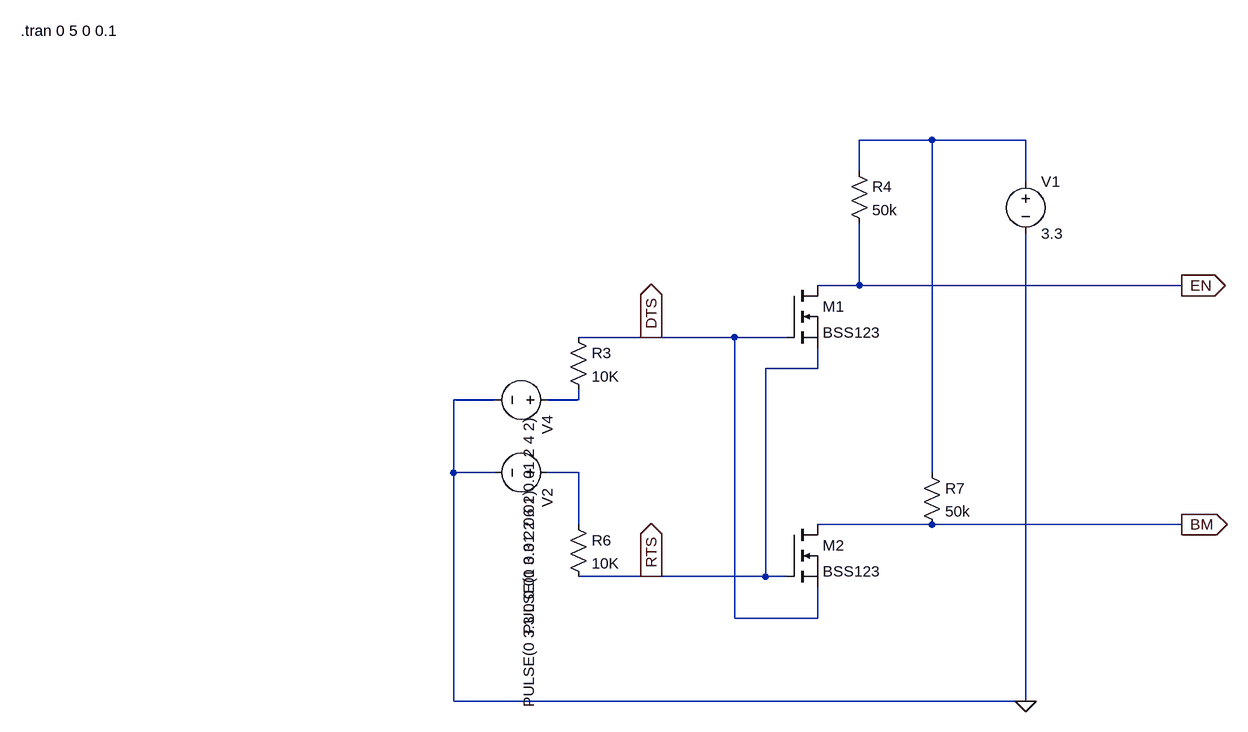
[diagram p0: schematic autoreset_wroom.asc]
autoreset_wroom.asc, the LTspice schematic file:
Version 4
SHEET 1 1028 816
WIRE 400 -80 288 -80
WIRE 544 -80 400 -80
WIRE 288 -32 288 -80
WIRE 544 -16 544 -80
WIRE 288 144 288 48
WIRE 288 144 224 144
WIRE 784 144 288 144
WIRE -32 224 -144 224
WIRE 96 224 -32 224
WIRE 176 224 96 224
WIRE 224 272 224 240
WIRE 224 272 144 272
WIRE -272 320 -336 320
WIRE -144 320 -144 304
WIRE -144 320 -192 320
WIRE -336 432 -336 320
WIRE -272 432 -336 432
WIRE -144 432 -192 432
WIRE 400 432 400 -80
WIRE -144 512 -144 432
WIRE 400 512 224 512
WIRE 784 512 400 512
WIRE -32 592 -144 592
WIRE 144 592 144 272
WIRE 144 592 -32 592
WIRE 176 592 144 592
WIRE 96 656 96 224
WIRE 224 656 224 608
WIRE 224 656 96 656
WIRE -336 784 -336 432
WIRE 544 784 544 64
WIRE 544 784 -336 784
FLAG 544 784 0
FLAG 784 144 EN
IOPIN 784 144 Out
FLAG 784 512 BM
IOPIN 784 512 Out
FLAG -32 224 DTS
IOPIN -32 224 Out
FLAG -32 592 RTS
IOPIN -32 592 Out
SYMBOL nmos 176 144 R0
SYMATTR InstName M1
SYMATTR Value BSS123
SYMBOL voltage 544 -32 R0
SYMATTR InstName V1
SYMATTR Value 3.3
SYMBOL res 272 -48 R0
SYMATTR InstName R4
SYMATTR Value 50k
SYMBOL voltage -176 320 R90
WINDOW 3 24 44 Left 2
WINDOW 123 0 0 Left 0
WINDOW 39 0 0 Left 0
SYMATTR InstName V4
SYMATTR Value PULSE(0 3.3 2 0.01 0.01 2 4 2)
SYMBOL res -160 208 R0
SYMATTR InstName R3
SYMATTR Value 10K
SYMBOL res -160 496 R0
SYMATTR InstName R6
SYMATTR Value 10K
SYMBOL res 384 416 R0
SYMATTR InstName R7
SYMATTR Value 50k
SYMBOL voltage -176 432 R90
WINDOW 3 24 44 Left 2
WINDOW 123 0 0 Left 0
WINDOW 39 0 0 Left 0
SYMATTR InstName V2
SYMATTR Value PULSE(0 3.3 0 0.01 0.01 2 6 2)
SYMBOL nmos 176 512 R0
SYMATTR InstName M2
SYMATTR Value BSS123
TEXT -1002 -248 Left 2 !.tran 0 5 0 0.1

The netlist it stands for:
* autoreset_wroom.asc
M1 EN DTS RTS RTS BSS123
V1 N001 0 3.3
R4 N001 EN 50k
V4 N002 0 PULSE(0 3.3 2 0.01 0.01 2 4 2)
R3 DTS N002 10K
R6 N003 RTS 10K
R7 N001 BM 50k
V2 N003 0 PULSE(0 3.3 0 0.01 0.01 2 6 2)
M2 BM RTS DTS DTS BSS123
.model NMOS NMOS
.model PMOS PMOS
.lib standard.mos
.tran 0 5 0 0.1
.backanno
.end